# EAGLE board Roland+memser (EAGLE 6.6.0), part 1 of 2
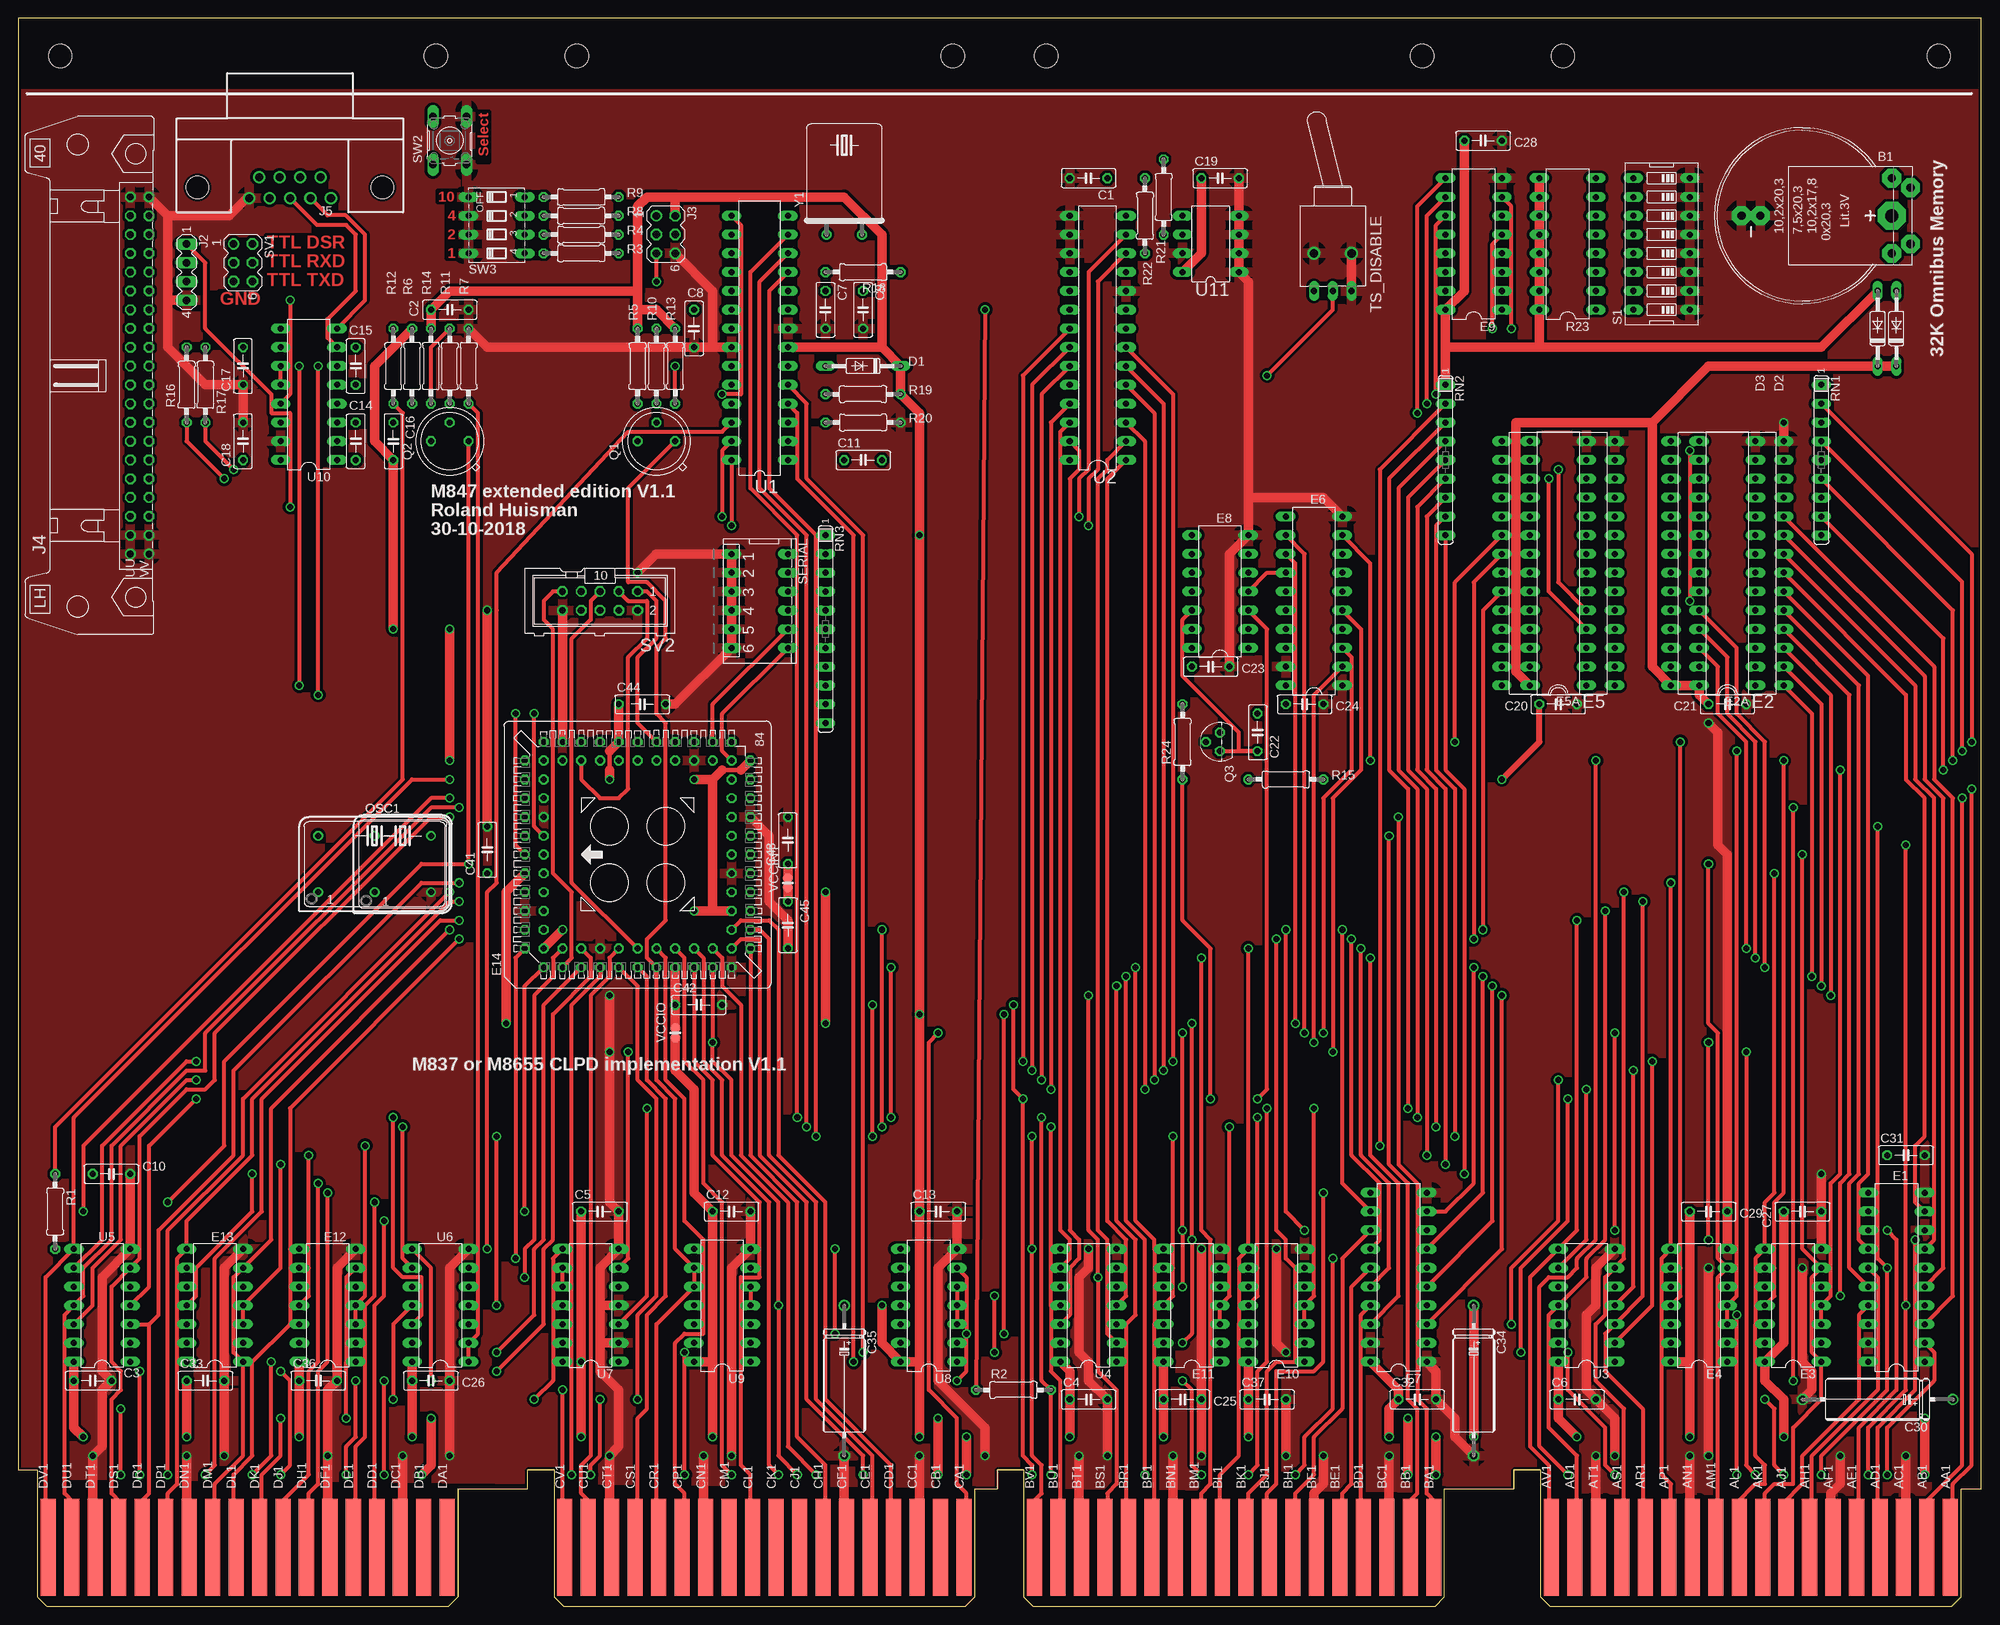
[diagram p5: board, top side]
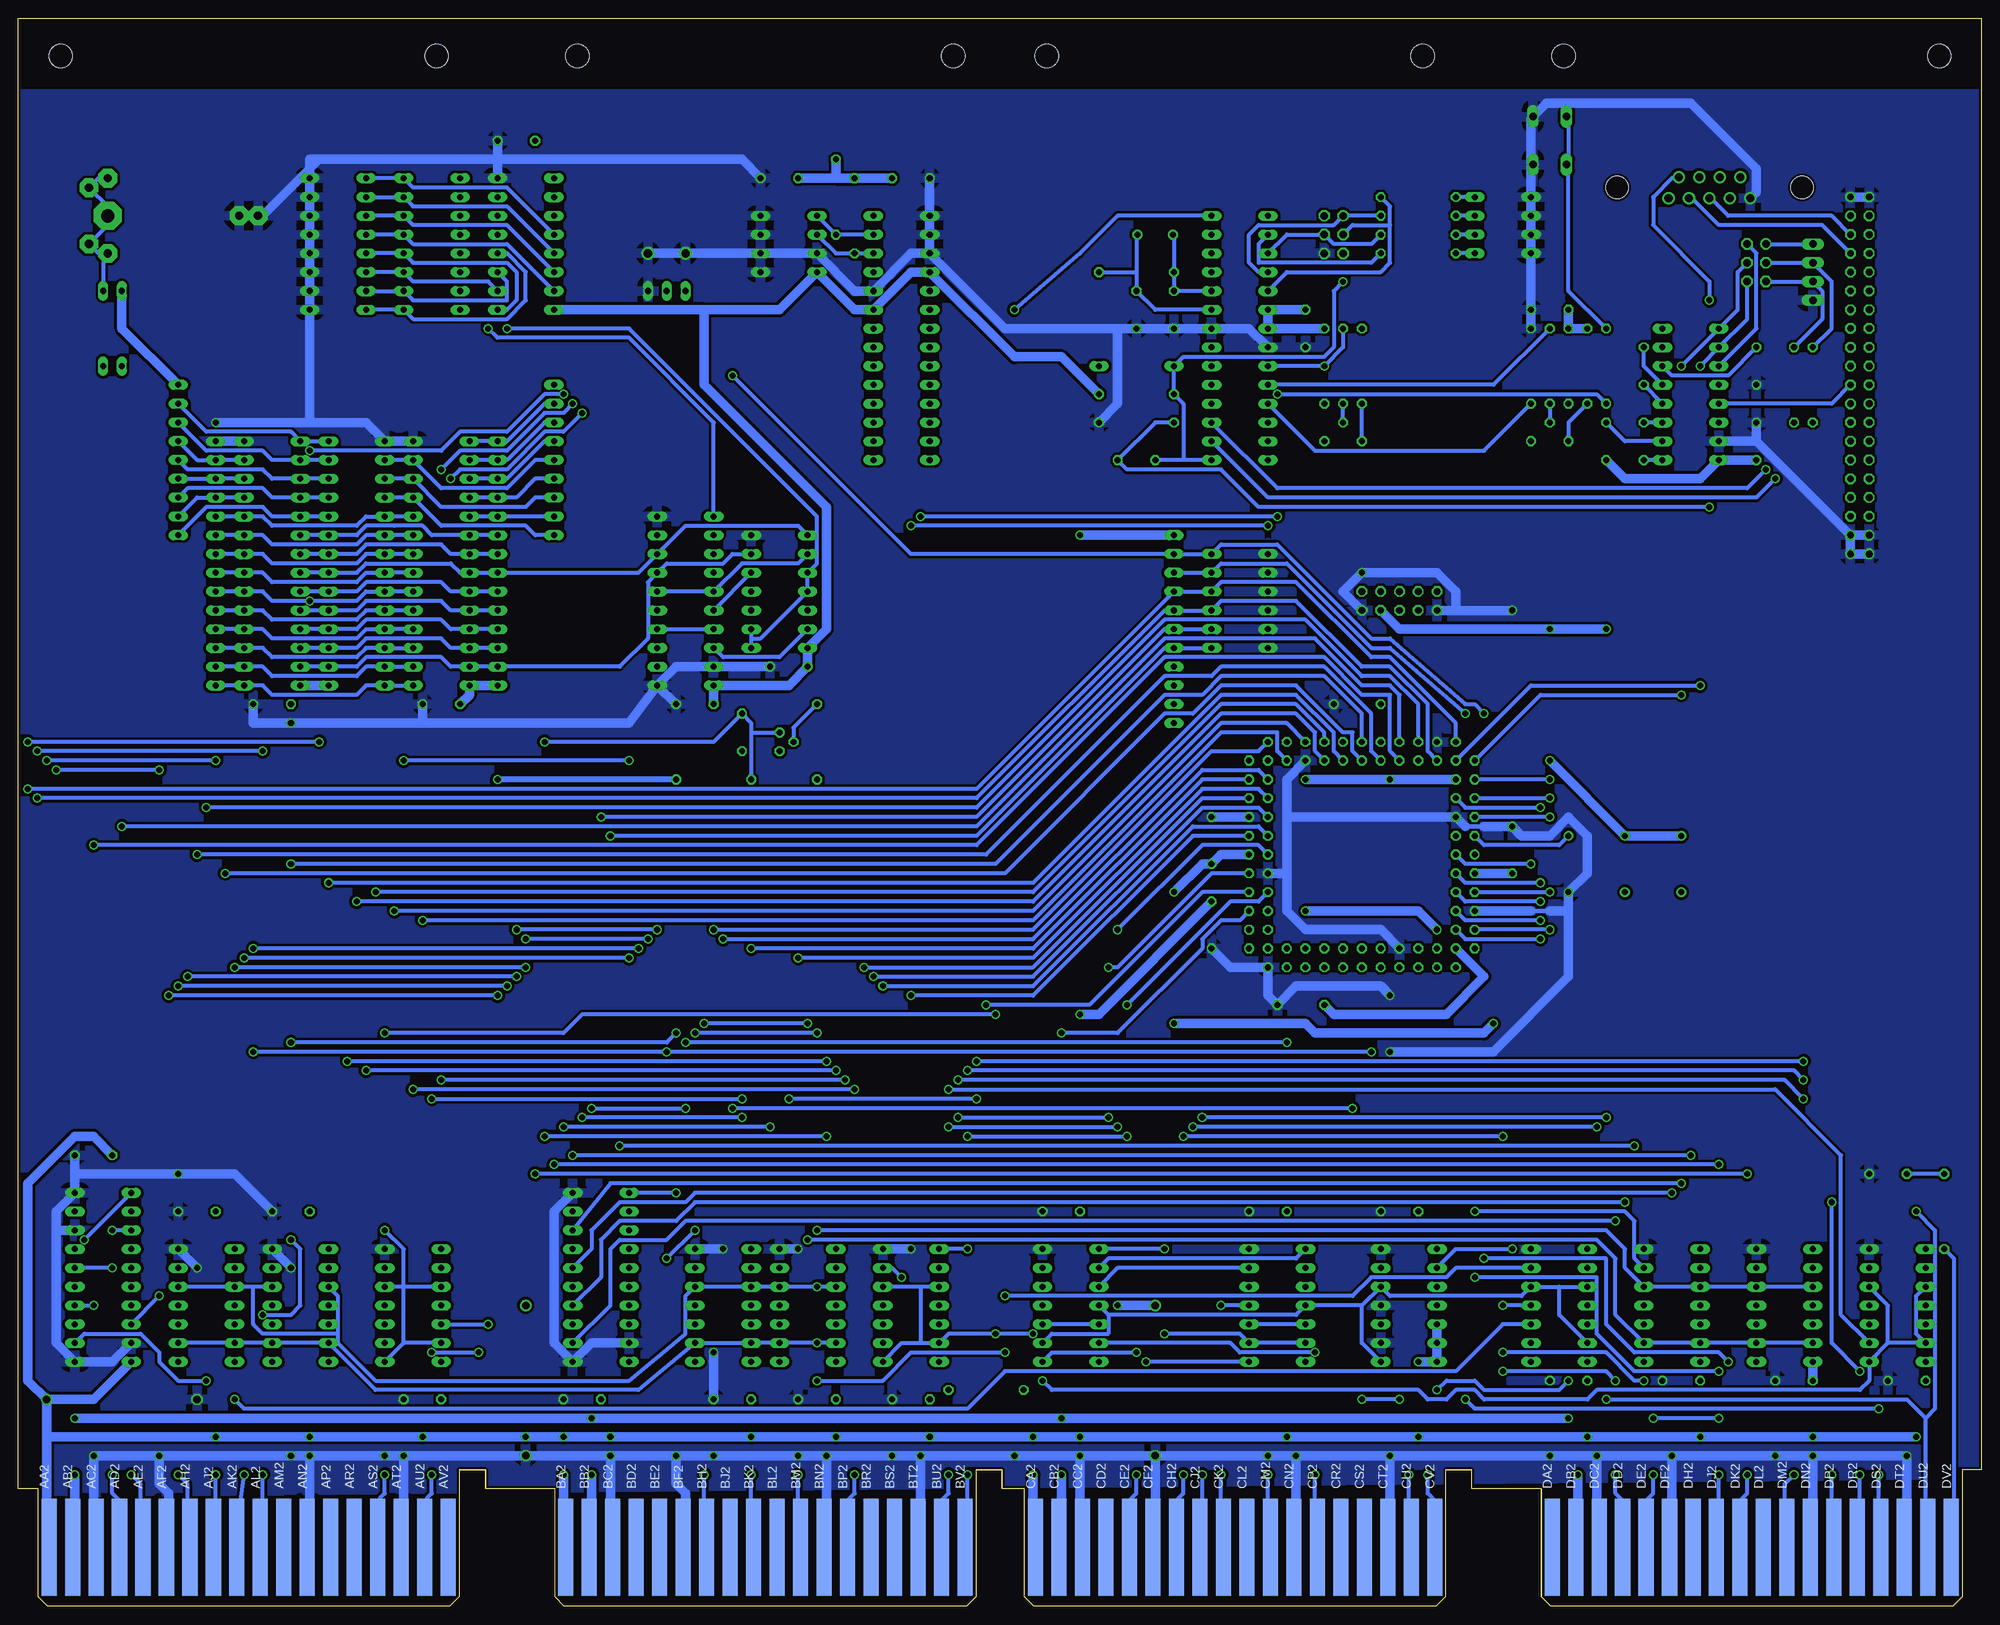
[diagram p6: board, bottom side, seen from below]

Size 265.3 x 214.63 mm. Coordinates in mm from the lower left corner, seen from the top.
Copper layers (1+16): Top 0.035mm / dielectric 1.5mm / Bottom 0.035mm
Design rules "16mils *": minimum track width 16mil, minimum drill 32mil, track to track 15mil, track to pad 10mil, pad to pad 10mil, via to via 10mil, smd to smd 10mil, copper to edge 13mil, drill to drill 10mil, minimum pad ring 10mil, minimum via ring 8mil, stop-mask expansion 0mil, vias tented up to drill 0mil, thermal gap 30mil
Net classes: 0 default: width 0.508 mm; 1 supply: width 1.27 mm

## Footprints (pad centres in the part's own frame; a part is rotated, then mirrored left to right if it is on the bottom)
B2430UNI = drill 1.118 pad 2.54 octagon: + 3.81,14.605; +@1 -3.81,14.605; +@2 -5.08,12.065; +@3 5.08,12.065; - 0,-5.715; -@1 0,-8.255 | drill 1.803 pad 3.81 octagon: +@4 0,12.065
C050-025X075 = drill 0.813 octagon: 1 -2.54,0; 2 2.54,0
E12-8 = drill 1.016: + -10.16,0 | drill 1.016 octagon: - 10.16,0
C063-025X075 = drill 0.813 octagon: 1 -2.54,0; 2 3.81,0
DO35-10 = drill 0.813 long: A 5.08,0; C -5.08,0
DIL20 = drill 0.813 long: 1 -11.43,-3.81; 2 -8.89,-3.81; 3 -6.35,-3.81; 4 -3.81,-3.81; 5 -1.27,-3.81; 6 1.27,-3.81; 7 3.81,-3.81; 8 6.35,-3.81; 9 8.89,-3.81; 10 11.43,-3.81; 11 11.43,3.81; 12 8.89,3.81; 13 6.35,3.81; 14 3.81,3.81; 15 1.27,3.81; 16 -1.27,3.81; 17 -3.81,3.81; 18 -6.35,3.81; 19 -8.89,3.81; 20 -11.43,3.81
DIL28-6 = drill 0.813 long: 1 -16.51,-7.62; 2 -13.97,-7.62; 3 -11.43,-7.62; 4 -8.89,-7.62; 5 -6.35,-7.62; 6 -3.81,-7.62; 7 -1.27,-7.62; 8 1.27,-7.62; 9 3.81,-7.62; 10 6.35,-7.62; 11 8.89,-7.62; 12 11.43,-7.62; 13 13.97,-7.62; 14 16.51,-7.62; 15 16.51,7.62; 16 13.97,7.62; 17 11.43,7.62; 18 8.89,7.62; 19 6.35,7.62; 20 3.81,7.62; 21 1.27,7.62; 22 -1.27,7.62; 23 -3.81,7.62; 24 -6.35,7.62; 25 -8.89,7.62; 26 -11.43,7.62; 27 -13.97,7.62; 28 -16.51,7.62
DIL28-3 = drill 0.813 long: 1 -16.51,-3.81; 2 -13.97,-3.81; 3 -11.43,-3.81; 4 -8.89,-3.81; 5 -6.35,-3.81; 6 -3.81,-3.81; 7 -1.27,-3.81; 8 1.27,-3.81; 9 3.81,-3.81; 10 6.35,-3.81; 11 8.89,-3.81; 12 11.43,-3.81; 13 13.97,-3.81; 14 16.51,-3.81; 15 16.51,3.81; 16 13.97,3.81; 17 11.43,3.81; 18 8.89,3.81; 19 6.35,3.81; 20 3.81,3.81; 21 1.27,3.81; 22 -1.27,3.81; 23 -3.81,3.81; 24 -6.35,3.81; 25 -8.89,3.81; 26 -11.43,3.81; 27 -13.97,3.81; 28 -16.51,3.81
DIL14 = drill 0.813 long: 1 -7.62,-3.81; 2 -5.08,-3.81; 3 -2.54,-3.81; 4 0,-3.81; 5 2.54,-3.81; 6 5.08,-3.81; 7 7.62,-3.81; 8 7.62,3.81; 9 5.08,3.81; 10 2.54,3.81; 11 0,3.81; 12 -2.54,3.81; 13 -5.08,3.81; 14 -7.62,3.81
DIL16 = drill 0.813 long: 1 -8.89,-3.81; 2 -6.35,-3.81; 3 -3.81,-3.81; 4 -1.27,-3.81; 5 1.27,-3.81; 6 3.81,-3.81; 7 6.35,-3.81; 8 8.89,-3.81; 9 8.89,3.81; 10 6.35,3.81; 11 3.81,3.81; 12 1.27,3.81; 13 -1.27,3.81; 14 -3.81,3.81; 15 -6.35,3.81; 16 -8.89,3.81
S84 = drill 0.813: 1 0,15.24 | drill 0.813 octagon: 2 0,12.7; 3 -2.54,15.24; 4 -2.54,12.7; 5 -5.08,15.24; 6 -5.08,12.7; 7 -7.62,15.24; 8 -7.62,12.7; 9 -10.16,15.24; 10 -10.16,12.7; 11 -12.7,15.24; 12 -15.24,12.7; 13 -12.7,12.7; 14 -15.24,10.16; 15 -12.7,10.16; 16 -15.24,7.62; 17 -12.7,7.62; 18 -15.24,5.08; 19 -12.7,5.08; 20 -15.24,2.54; 21 -12.7,2.54; 22 -15.24,0; 23 -12.7,0; 24 -15.24,-2.54; 25 -12.7,-2.54; 26 -15.24,-5.08; 27 -12.7,-5.08; 28 -15.24,-7.62; 29 -12.7,-7.62; 30 -15.24,-10.16; 31 -12.7,-10.16; 32 -15.24,-12.7; 33 -12.7,-15.24; 34 -12.7,-12.7; 35 -10.16,-15.24; 36 -10.16,-12.7; 37 -7.62,-15.24; 38 -7.62,-12.7; 39 -5.08,-15.24; 40 -5.08,-12.7; 41 -2.54,-15.24; 42 -2.54,-12.7; 43 0,-15.24; 44 0,-12.7; 45 2.54,-15.24; 46 2.54,-12.7; 47 5.08,-15.24; 48 5.08,-12.7; 49 7.62,-15.24; 50 7.62,-12.7; 51 10.16,-15.24; 52 10.16,-12.7; 53 12.7,-15.24; 54 15.24,-12.7; 55 12.7,-12.7; 56 15.24,-10.16; 57 12.7,-10.16; 58 15.24,-7.62; 59 12.7,-7.62; 60 15.24,-5.08; 61 12.7,-5.08; 62 15.24,-2.54; 63 12.7,-2.54; 64 15.24,0; 65 12.7,0; 66 15.24,2.54; 67 12.7,2.54; 68 15.24,5.08; 69 12.7,5.08; 70 15.24,7.62; 71 12.7,7.62; 72 15.24,10.16; 73 12.7,10.16; 74 15.24,12.7; 75 12.7,15.24; 76 12.7,12.7; 77 10.16,15.24; 78 10.16,12.7; 79 7.62,15.24; 80 7.62,12.7; 81 5.08,15.24; 82 5.08,12.7; 83 2.54,15.24; 84 2.54,12.7
EDGE-CON8 = smd 2.032 x 13.106: AA1 261.303,7.938; AB1 258.127,7.938; AC1 254.952,7.938; AD1 251.778,7.938; AE1 248.602,7.938; AF1 245.428,7.938; AH1 242.252,7.938; AJ1 239.077,7.938; AK1 235.903,7.938; AL1 232.727,7.938; AM1 229.553,7.938; AN1 226.377,7.938; AP1 223.202,7.938; AR1 220.028,7.938; AS1 216.852,7.938; AT1 213.678,7.938; AU1 210.502,7.938; AV1 207.327,7.938; BA1 191.452,7.938; BB1 188.278,7.938; BC1 185.102,7.938; BD1 181.928,7.938; BE1 178.752,7.938; BF1 175.577,7.938; BH1 172.403,7.938; BJ1 169.227,7.938; BK1 166.053,7.938; BL1 162.877,7.938; BM1 159.702,7.938; BN1 156.528,7.938; BP1 153.352,7.938; BR1 150.178,7.938; BS1 147.002,7.938; BT1 143.827,7.938; BU1 140.653,7.938; BV1 137.477,7.938; CA1 127.953,7.938; CB1 124.778,7.938; CC1 121.603,7.938; CD1 118.427,7.938; CE1 115.252,7.938; CF1 112.078,7.938; CH1 108.903,7.938; CJ1 105.728,7.938; CK1 102.552,7.938; CL1 99.377,7.938; CM1 96.203,7.938; CN1 93.028,7.938; CP1 89.853,7.938; CR1 86.677,7.938; CS1 83.502,7.938; CT1 80.328,7.938; CU1 77.153,7.938; CV1 73.978,7.938; DA1 58.102,7.938; DB1 54.928,7.938; DC1 51.752,7.938; DD1 48.578,7.938; DE1 45.403,7.938; DF1 42.227,7.938; DH1 39.053,7.938; DJ1 35.877,7.938; DK1 32.703,7.938; DL1 29.527,7.938; DM1 26.352,7.938; DN1 23.177,7.938; DP1 20.003,7.938; DR1 16.828,7.938; DS1 13.652,7.938; DT1 10.477,7.938; DU1 7.303,7.938; DV1 4.128,7.938 | smd 2.032 x 13.106 bottom: AA2 261.303,7.938; AB2 258.127,7.938; AC2 254.952,7.938; AD2 251.778,7.938; AE2 248.602,7.938; AF2 245.428,7.938; AH2 242.252,7.938; AJ2 239.077,7.938; AK2 235.903,7.938; AL2 232.727,7.938; AM2 229.553,7.938; AN2 226.377,7.938; AP2 223.202,7.938; AR2 220.028,7.938; AS2 216.852,7.938; AT2 213.678,7.938; AU2 210.502,7.938; AV2 207.327,7.938; BA2 191.452,7.938; BB2 188.278,7.938; BC2 185.102,7.938; BD2 181.928,7.938; BE2 178.752,7.938; BF2 175.577,7.938; BH2 172.403,7.938; BJ2 169.227,7.938; BK2 166.053,7.938; BL2 162.877,7.938; BM2 159.702,7.938; BN2 156.528,7.938; BP2 153.352,7.938; BR2 150.178,7.938; BS2 147.002,7.938; BT2 143.827,7.938; BU2 140.653,7.938; BV2 137.477,7.938; CA2 127.953,7.938; CB2 124.778,7.938; CC2 121.603,7.938; CD2 118.427,7.938; CE2 115.252,7.938; CF2 112.078,7.938; CH2 108.903,7.938; CJ2 105.728,7.938; CK2 102.552,7.938; CL2 99.377,7.938; CM2 96.203,7.938; CN2 93.028,7.938; CP2 89.853,7.938; CR2 86.677,7.938; CS2 83.502,7.938; CT2 80.328,7.938; CU2 77.153,7.938; CV2 73.978,7.938; DA2 58.102,7.938; DB2 54.928,7.938; DC2 51.752,7.938; DD2 48.578,7.938; DE2 45.403,7.938; DF2 42.227,7.938; DH2 39.053,7.938; DJ2 35.877,7.938; DK2 32.703,7.938; DL2 29.527,7.938; DM2 26.352,7.938; DN2 23.177,7.938; DP2 20.003,7.938; DR2 16.828,7.938; DS2 13.652,7.938; DT2 10.477,7.938; DU2 7.303,7.938; DV2 4.128,7.938
MA04-1 = drill 1.016 long: 1 -3.81,0; 2 -1.27,0; 3 1.27,0; 4 3.81,0
MA03-2 = drill 1.016: 1 -2.54,-1.27 | drill 1.016 octagon: 2 -2.54,1.27; 3 0,-1.27; 4 0,1.27; 5 2.54,-1.27; 6 2.54,1.27
DEC40PINH = drill 0.914 octagon: A 24.13,1.27; AA -3.81,1.27; B 24.13,-1.27; BB -3.81,-1.27; C 21.59,1.27; CC -6.35,1.27; D 21.59,-1.27; DD -6.35,-1.27; E 19.05,1.27; EE -8.89,1.27; F 19.05,-1.27; FF -8.89,-1.27; H 16.51,1.27; HH -11.43,1.27; J 16.51,-1.27; JJ -11.43,-1.27; K 13.97,1.27; KK -13.97,1.27; L 13.97,-1.27; LL -13.97,-1.27; M 11.43,1.27; MM -16.51,1.27; N 11.43,-1.27; NN -16.51,-1.27; P 8.89,1.27; PP -19.05,1.27; R 8.89,-1.27; RR -19.05,-1.27; S 6.35,1.27; SS -21.59,1.27; T 6.35,-1.27; TT -21.59,-1.27; U 3.81,1.27; UU -24.13,1.27; V 3.81,-1.27; W 1.27,1.27; X 1.27,-1.27; Y -1.27,1.27; Z -1.27,-1.27 | drill 0.914: VV -24.13,-1.27
H5M09RA = drill 1.092: 1 -5.537,1.422; 2 -2.769,1.422; 3 0,1.422; 4 2.769,1.422; 5 5.537,1.422; 6 -4.153,-1.422; 7 -1.384,-1.422; 8 1.384,-1.422; 9 4.153,-1.422 | hole 3.048: -12.497,0; 12.497,0
DIL08S = drill 0.813: 1 -3.81,-3.81; 4 3.81,-3.81; 5 3.81,3.81; 8 -3.81,3.81
DIL14S = drill 0.813: 1 -7.62,-3.81; 7 7.62,-3.81; 8 7.62,3.81; 14 -7.62,3.81
TO5 = drill 0.813 octagon: 1 0,-2.54; 2 2.54,0; 3 0,2.54
TO92 = drill 0.813 octagon: 1 1.27,0; 2 0,1.905; 3 -1.27,0
0207/10 = drill 0.813 octagon: 1 -5.08,0; 2 5.08,0
SIL9 = drill 0.813 long: 1 -10.16,0; 2 -7.62,0; 3 -5.08,0; 4 -2.54,0; 5 0,0; 6 2.54,0; 7 5.08,0; 8 7.62,0; 9 10.16,0
SIL11 = drill 0.813 long: 1 -12.7,0; 2 -10.16,0; 3 -7.62,0; 4 -5.08,0; 5 -2.54,0; 6 0,0; 7 2.54,0; 8 5.08,0; 9 7.62,0; 10 10.16,0; 11 12.7,0
EDG-08 = drill 0.813 long: 1 -8.89,-3.81; 2 -6.35,-3.81; 3 -3.81,-3.81; 4 -1.27,-3.81; 5 1.27,-3.81; 6 3.81,-3.81; 7 6.35,-3.81; 8 8.89,-3.81; 9 8.89,3.81; 10 6.35,3.81; 11 3.81,3.81; 12 1.27,3.81; 13 -1.27,3.81; 14 -3.81,3.81; 15 -6.35,3.81; 16 -8.89,3.81
DP-06 = drill 0.813 long: 1 -6.35,-3.81; 2 -3.81,-3.81; 3 -1.27,-3.81; 4 1.27,-3.81; 5 3.81,-3.81; 6 6.35,-3.81; 7 6.35,3.81; 8 3.81,3.81; 9 1.27,3.81; 10 -1.27,3.81; 11 -3.81,3.81; 12 -6.35,3.81
ML10 = drill 0.914 octagon: 1 -5.08,-1.27; 2 -5.08,1.27; 3 -2.54,-1.27; 4 -2.54,1.27; 5 0,-1.27; 6 0,1.27; 7 2.54,-1.27; 8 2.54,1.27; 9 5.08,-1.27; 10 5.08,1.27
B3F-10XX = drill 1.016 long: 1 -3.251,2.261; 2 3.251,2.261; 3 -3.251,-2.261; 4 3.251,-2.261
DIP04S = drill 0.813 long: 1 -3.81,-3.81; 2 -1.27,-3.81; 3 1.27,-3.81; 4 3.81,-3.81; 5 3.81,3.81; 6 1.27,3.81; 7 -1.27,3.81; 8 -3.81,3.81
9070-1W = drill 0.813 long: 1 5.08,-2.54; 2 5.08,0; 3 5.08,2.54 | drill 1.118 pad 1.778: B 0,-2.54; B1 0,2.54
DIL8 = drill 0.813 long: 1 -3.81,-3.81; 2 -1.27,-3.81; 3 1.27,-3.81; 4 3.81,-3.81; 5 3.81,3.81; 6 1.27,3.81; 7 -1.27,3.81; 8 -3.81,3.81
OMNIBUS = hole 3.175: 208.915,209.55; 259.715,209.55; 189.865,209.55; 139.065,209.55; 75.616,209.55; 126.416,209.55; 56.566,209.55; 5.766,209.55
NC1 = smd 1.346 x 1.346: 1 -0.635,0; 2 0.635,0
HC49U-H = drill 0.813: 1 -2.413,-5.08; 2 2.413,-5.08

## Placement (x,y rotation side)
B1  CR2032  [B2430UNI]  241.17,187.96 270 top
C1  100nF  [C050-025X075]  144.65,193.04 180 top
C2  100nF  [C050-025X075]  58.29,175.26 0 top
C3  100nF  [C050-025X075]  10.03,30.48 0 top
C4  100nF  [C050-025X075]  144.65,27.94 0 top
C5  100nF  [C050-025X075]  78.61,53.34 0 top
C6  100nF  [C050-025X075]  210.69,27.94 0 top
C7  22pF  [C050-025X075]  109.09,175.26 270 top
C8  100nF  [C050-025X075]  91.31,172.72 270 top
C9  22pF  [C050-025X075]  114.17,175.26 270 top
C10  100nF  [C050-025X075]  12.57,58.42 0 top
C11  100nF  [C050-025X075]  114.17,154.94 0 top
C12  100nF  [C050-025X075]  96.39,53.34 0 top
C13  100nF  [C050-025X075]  124.33,53.34 0 top
C14  100nF  [C050-025X075]  45.59,157.48 90 top
C15  100nF  [C050-025X075]  45.59,167.64 90 top
C16  100nF  [C050-025X075]  50.67,157.48 270 top
C17  100nF  [C050-025X075]  30.35,167.64 90 top
C18  100nF  [C050-025X075]  30.35,157.48 90 top
C19  100nF  [C050-025X075]  162.43,193.04 0 top
C20  100nF  [C050-025X075]  208.15,121.92 0 top
C21  100nF  [C050-025X075]  231.01,121.92 0 top
C22  200pF  [C050-025X075]  167.51,118.11 270 top
C23  100nF  [C050-025X075]  161.16,127 0 top
C24  100nF  [C050-025X075]  173.86,121.92 0 top
C25  100nF  [C050-025X075]  157.35,27.94 0 top
C26  100nF  [C050-025X075]  55.75,30.48 0 top
C27  100nF  [C050-025X075]  241.17,53.34 0 top
C28  100nF  [C050-025X075]  197.99,198.12 0 top
C29  100nF  [C050-025X075]  228.47,53.34 0 top
C30  6.8uF  [E12-8]  251.33,27.94 180 top
C31  100nF  [C050-025X075]  255.14,60.96 0 top
C32  100nF  [C050-025X075]  189.1,27.94 0 top
C33  100nF  [C050-025X075]  25.27,30.48 0 top
C34  6.8uF  [E12-8]  196.72,30.48 270 top
C35  6.8uF  [E12-8]  111.63,30.48 270 top
C36  100nF  [C050-025X075]  40.51,30.48 0 top
C37  100nF  [C050-025X075]  168.78,27.94 0 top
C41  .22uF  [C063-025X075]  63.37,101.6 90 top
C42  .22uF  [C063-025X075]  91.31,81.28 0 top
C43  .22uF  [C063-025X075]  104.01,102.87 90 top
C44  .22uF  [C063-025X075]  83.69,121.92 0 top
C45  .22uF  [C063-025X075]  104.01,92.71 270 top
D1  1N4148  [DO35-10]  114.17,167.64 180 top
D2  BAT86  [DO35-10]  253.87,172.72 90 top
D3  BAT86  [DO35-10]  251.33,172.72 90 top
E1  74LS244N  [DIL20]  253.87,44.45 90 top
E2  62256  [DIL28-6]  231.01,140.97 90 top
E2A  62256  [DIL28-3]  231.01,140.97 90 top
E3  74LS38N  [DIL14]  239.9,40.64 90 top
E4  74LS38N  [DIL14]  227.2,40.64 90 top
E5  62256  [DIL28-6]  208.15,140.97 90 top
E5A  62256  [DIL28-3]  208.15,140.97 90 top
E6  74LS540N  [DIL20]  175.13,135.89 90 top
E7  74LS244N  [DIL20]  186.56,44.45 90 top
E8  74LS10N  [DIL14]  162.43,137.16 90 top
E9  74LS151N  [DIL16]  196.72,184.15 90 top
E10  74LS38N  [DIL14]  170.05,40.64 90 top
E11  74LS38N  [DIL14]  158.62,40.64 90 top
E12  74LS38N  [DIL14]  41.78,40.64 90 top
E13  74LS38N  [DIL14]  26.54,40.64 90 top
E14  ATF150X84  [S84]  83.69,101.6 90 top
J1  EDGE  [EDGE-CON8]  -0.13,0 0 top
J2  COMM  [MA04-1]  22.73,180.34 270 top
J3  ICSP  [MA03-2]  87.5,185.42 270 top
J4  Serial  [DEC40PINH]  16.38,166.37 90 top
J5  D-SUB9-HM  [H5M09RA]  36.7,191.77 180 top
OSC  19.6608 MHz  [DIL08S]  51.94,100.33 0 top
OSC1  19.6608 MHz  [DIL14S]  48.13,100.33 0 top
Q1  BC547  [TO5]  86.23,157.48 90 top
Q2  BC547  [TO5]  58.29,157.48 90 top
Q3  2N3904  [TO92]  162.43,116.84 90 top
R1  1K  [0207/10]  4.95,53.34 270 top
R2  1K  [0207/10]  134.49,29.21 0 top
R3  1K  [0207/10]  76.07,182.88 180 top
R4  1K  [0207/10]  76.07,185.42 180 top
R5  27  [0207/10]  83.69,167.64 90 top
R6  27  [0207/10]  53.21,167.64 90 top
R7  4.7K  [0207/10]  60.83,167.64 270 top
R8  1K  [0207/10]  76.07,187.96 180 top
R9  1K  [0207/10]  76.07,190.5 180 top
R10  27  [0207/10]  86.23,167.64 270 top
R11  27  [0207/10]  58.29,167.64 270 top
R12  47  [0207/10]  50.67,167.64 90 top
R13  470  [0207/10]  88.77,167.64 90 top
R14  470  [0207/10]  55.75,167.64 90 top
R15  100K  [0207/10]  171.32,111.76 0 top
R16  1K  [0207/10]  22.73,165.1 90 top
R17  1K  [0207/10]  25.27,165.1 90 top
R18  1M  [0207/10]  114.17,180.34 180 top
R19  10K  [0207/10]  114.17,163.83 0 top
R20  1K  [0207/10]  114.17,160.02 180 top
R21  4.7K  [0207/10]  154.81,190.5 90 top
R22  4.7K  [0207/10]  152.27,187.96 90 top
R23  10K  [DIL16]  209.42,184.15 90 top
R24  100K  [0207/10]  157.35,116.84 90 top
RN1  5K  [SIL9]  243.71,154.94 270 top
RN2  5K  [SIL9]  192.91,154.94 270 top
RN3  47K  [SIL11]  109.09,132.08 270 top
S1  01234567  [EDG-08]  222.12,184.15 90 top
SERIAL  CONF  [DP-06]  100.2,135.89 270 top
SV1  ARDEBUG  [MA03-2]  30.35,181.61 270 top
SV2  [ML10]  78.61,135.89 180 top
SW2  10-XX  [B3F-10XX]  58.29,198.12 90 top
SW3  DIP-4  [DIP04S]  64.64,186.69 270 top
TS_DISABLE  M837  [9070-1W]  177.67,182.88 270 top
U1  MEGA328-P  [DIL28-3]  100.2,171.45 90 top
U2  MCP23017SP  [DIL28-3]  145.92,171.45 90 top
U3  74LS38N  [DIL14]  211.96,40.64 90 top
U4  74LS38N  [DIL14]  144.65,40.64 90 top
U5  74LS38N  [DIL14]  11.3,40.64 90 top
U6  74LS38N  [DIL14]  57.02,40.64 90 top
U7  74LS38N  [DIL14]  77.34,40.64 90 top
U8  74LS10N  [DIL14]  123.06,40.64 90 top
U9  74LS00N  [DIL14]  95.12,40.64 90 top
U10  MAX232  [DIL16]  39.24,163.83 90 top
U11  24LC1025P  [DIL8]  161.16,184.15 90 top
U$1  OUTLINE-OMNIBUS  [OMNIBUS]  -0.13,0 0 top
VCCINT  JUMPER-NC1  [NC1]  104.01,97.79 90 top
VCCIO  JUMPER-NC1  [NC1]  88.77,77.47 90 top
Y1  16.000MHz  [HC49U-H]  111.63,190.5 0 top